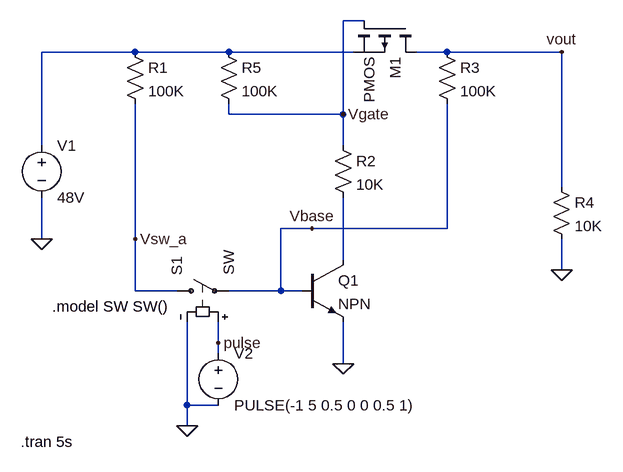
[diagram p0: schematic latch.asc]
latch.asc, the LTspice schematic file:
Version 4
SHEET 1 880 680
WIRE 480 -32 448 -32
WIRE 128 16 -16 16
WIRE 272 16 128 16
WIRE 464 16 272 16
WIRE 608 16 560 16
WIRE 784 16 608 16
WIRE 272 112 272 96
WIRE 448 112 448 -32
WIRE 448 112 272 112
WIRE -16 160 -16 16
WIRE 448 160 448 112
WIRE 784 224 784 16
WIRE 400 288 352 288
WIRE 608 288 608 96
WIRE 608 288 400 288
WIRE -16 304 -16 240
WIRE 128 304 128 96
WIRE 448 336 448 240
WIRE 784 352 784 304
WIRE 128 384 128 304
WIRE 192 384 128 384
WIRE 352 384 352 288
WIRE 352 384 272 384
WIRE 384 384 352 384
WIRE 256 464 256 432
WIRE 256 480 256 464
WIRE 448 496 448 432
WIRE 208 560 208 432
WIRE 256 560 208 560
WIRE 208 592 208 560
FLAG 448 496 0
FLAG -16 304 0
FLAG 208 592 0
FLAG 784 352 0
FLAG 784 16 vout
FLAG 256 464 pulse
FLAG 400 288 Vbase
FLAG 448 112 Vgate
FLAG 128 304 Vsw_a
SYMBOL voltage -16 144 R0
WINDOW 123 0 0 Left 0
WINDOW 39 0 0 Left 0
SYMATTR InstName V1
SYMATTR Value 48V
SYMBOL pmos 560 -32 R90
SYMATTR InstName M1
SYMBOL res 112 0 R0
SYMATTR InstName R1
SYMATTR Value 100K
SYMBOL res 432 144 R0
SYMATTR InstName R2
SYMATTR Value 10K
SYMBOL res 592 0 R0
SYMATTR InstName R3
SYMATTR Value 100K
SYMBOL npn 384 336 R0
SYMATTR InstName Q1
SYMBOL voltage 256 464 R0
WINDOW 123 0 0 Left 0
WINDOW 39 0 0 Left 0
SYMATTR InstName V2
SYMATTR Value PULSE(-1 5 0.5 0 0 0.5 1)
SYMBOL sw 176 384 R270
SYMATTR InstName S1
SYMBOL res 768 208 R0
SYMATTR InstName R4
SYMATTR Value 10K
SYMBOL res 256 0 R0
SYMATTR InstName R5
SYMATTR Value 100K
TEXT -48 616 Left 2 !.tran 5s
TEXT 0 408 Left 2 !.model SW SW()

The netlist it stands for:
* latch.asc
V1 N001 0 48V
M1 vout Vgate N001 N001 PMOS
R1 N001 Vsw_a 100K
R2 Vgate N002 10K
R3 vout Vbase 100K
Q1 N002 Vbase 0 0 NPN
V2 pulse 0 PULSE(-1 5 0.5 0 0 0.5 1)
S1 Vsw_a Vbase pulse 0 SW
R4 vout 0 10K
R5 N001 Vgate 100K
.model NPN NPN
.model PNP PNP
.lib standard.bjt
.model NMOS NMOS
.model PMOS PMOS
.lib standard.mos
.tran 5s
.model SW SW()
.backanno
.end